# EAGLE design TailBoardA (EAGLE 9.1.3)
CNAME: BotaLab; CREVISION: 1.1; DESIGNER: botamochi6277
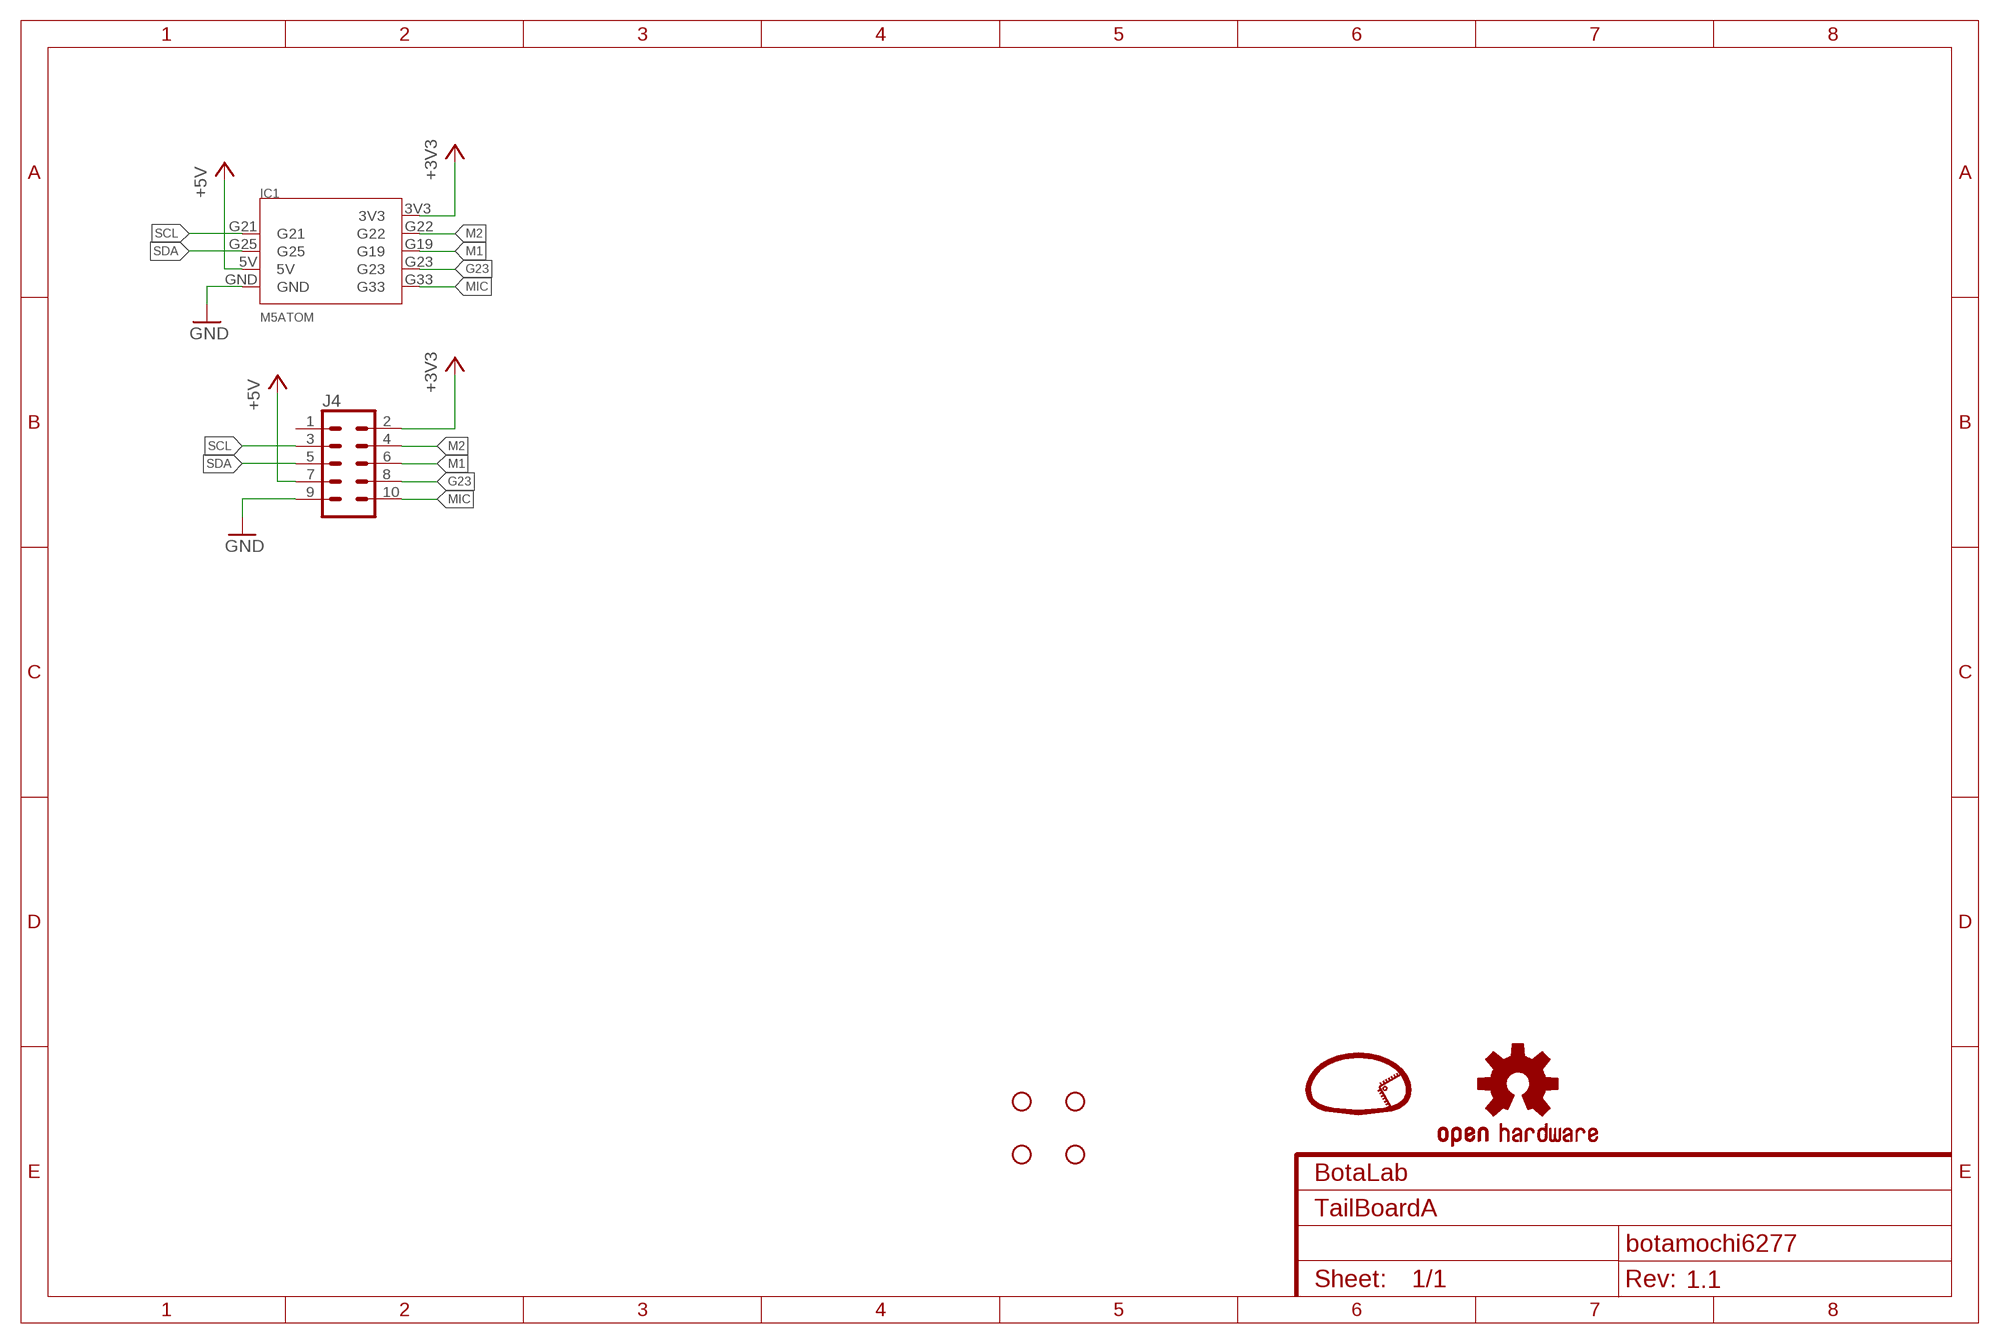
[diagram p0: schematic, sheet 1]

## Parts
H1  STAND-OFF2.1  [STAND-OFF-2.1]
H2  STAND-OFF2.1  [STAND-OFF-2.1]
H3  STAND-OFF2.1  [STAND-OFF-2.1]
H4  STAND-OFF2.1  [STAND-OFF-2.1]
IC1  M5ATOM  [M5ATOM]
J4  CONN_05X2SHD  [2X5-SHROUDED]
LOGO1  LOGO  [LOGO]
LOGO2  OSHW-LOGOS  [OSHW-LOGO-S]

## Nets
+3V3 [pwr]: IC1.3V3 J4.2
+5V [pwr]: IC1.5V J4.7
G23: IC1.G23 J4.8
GND [pwr]: IC1.GND J4.9
M1: IC1.G19 J4.6
M2: IC1.G22 J4.4
MIC: IC1.G33 J4.10
SCL: IC1.G21 J4.3
SDA: IC1.G25 J4.5
Unconnected: J4.1

## Library data of the parts
H1-H4 = Botamochi-sensors:STAND-OFF: Stand Off Drill holes for mechanically mounting via screws, standoffs, etc. Note: Use the keepout ring to avoid running the screw head into surrounding components. Variant Overviews STAND-OFF - Mechanical footprint for a #4 phillips button head screw. STAND-OFF-TIGHT - Mechanical footprint for a #4 phillips button head screw, Example SparkFun Products Screw - Phillips Head (1/4", 4-40, 10 pack) <https://www.sparkfun.com/products/10453> (PRT-10453) Screw - Phillips Head (1/2", 4-40, 10 pack) <https://www.sparkfun.com/products/10452> (PRT-10452) Screw - Phillips Head (3/4", 4-40, 10 pack) <https://www.sparkfun.com/products/10451> (PRT-10451) Screw - Phillips Head (1", 4-40, 10 pack) <https://www.sparkfun.com/products/10450> (PRT-10450)
IC1 = M5Atom:M5ATOM: Design for M5Atom Series
J4 = SparkFun-Connectors:CONN_05X2: Multi connection point. Often used as Generic Header-pin footprint for 0.1 inch spaced/style header connections For AVR SPI programming port, see special device with nice symbol: "AVR_SPI_PROG_5x2.dev" You can populate with any combo of single row headers, but if you'd like an exact match, check these: 2x5 AVR ICSP Male Header <https://www.sparkfun.com/products/778> (PRT-00778) 2x5 Pin Shrouded Header <https://www.sparkfun.com/products/8506> (PRT-08506) On any of the 0.1 inch spaced packages, you can populate with these: Break Away Headers - Straight <https://www.sparkfun.com/products/116> (PRT-00116) Break Away Male Headers - Right Angle <https://www.sparkfun.com/products/553> (PRT-00553) Female Headers <https://www.sparkfun.com/products/115> (PRT-00115) Break Away Headers - Machine Pin <https://www.sparkfun.com/products/117> (PRT-00117) Break Away Female Headers - Swiss Machine Pin <https://www.sparkfun.com/products/743> (PRT-00743) Special note: the shrouded connector mates well with our 5x2 ribbon cables: 2x5 Pin IDC Ribbon Cable <https://www.sparkfun.com/products/8535> (PRT-08535); PROD_ID: CONN-08671; SF_ID: PRT-08506
LOGO1 = botamochi-symbol:LOGO
LOGO2 = SparkFun-Aesthetics:OSHW-LOGO: Open-Source Hardware (OSHW) Logo This logo indicates the piece of hardware it is found on incorporates a OSHW license and/or adheres to the definition of open source hardware found here: http://freedomdefined.org/OSHW

## Net classes
0 default: width 0.5 mm
1 pwr: width 1 mm, clearance 0.5 mm

## Board
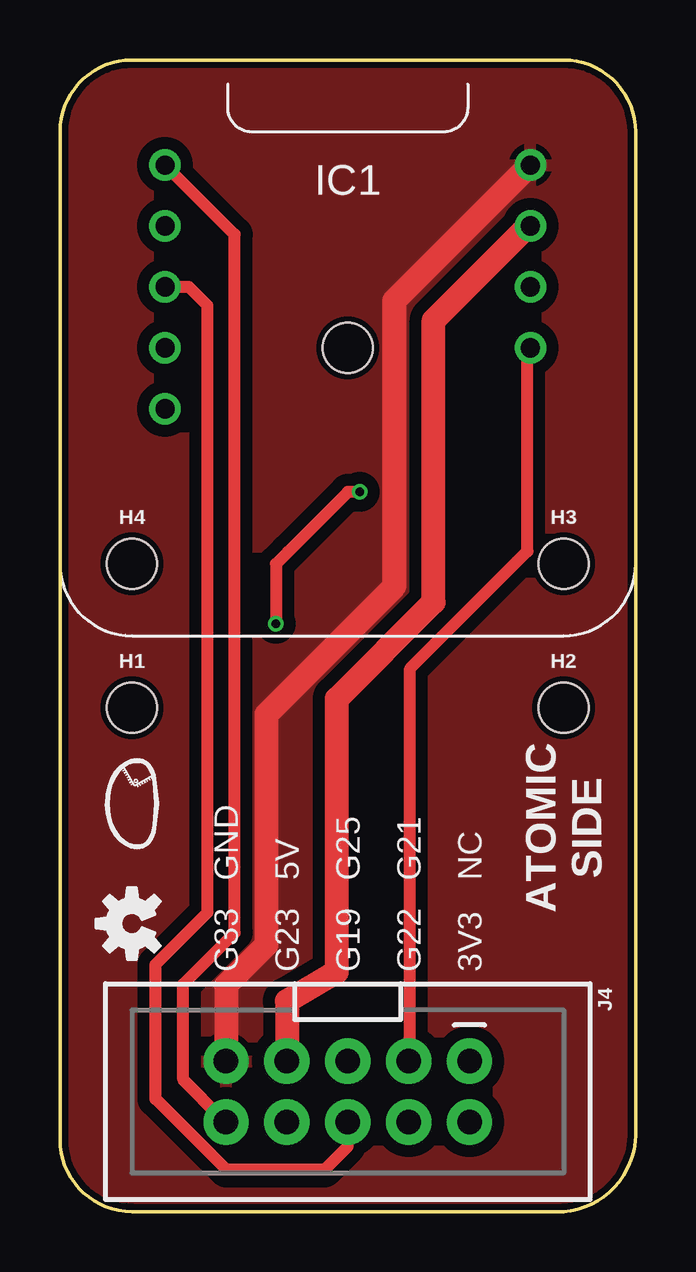
[diagram p1: board, top side]
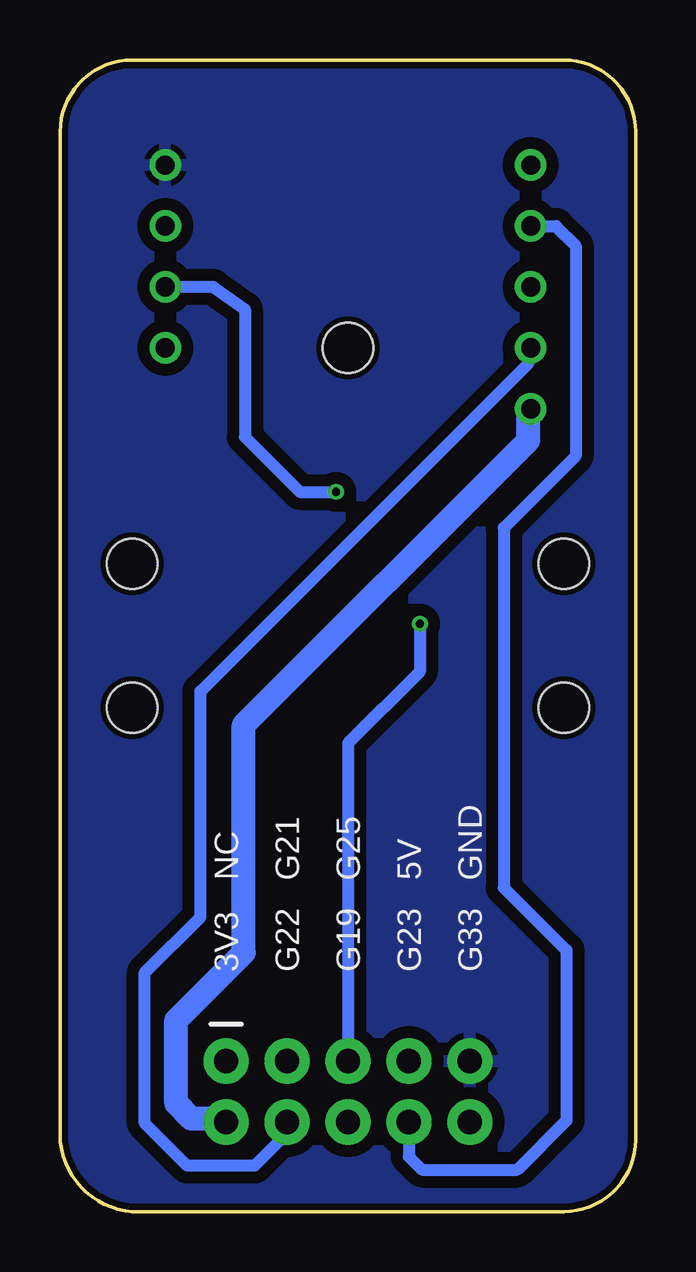
[diagram p2: board, bottom side, seen from below]

Size 24.01 x 48 mm. Coordinates in mm from the lower left corner, seen from the top.
Outline: 21,0 arc90 24,3.5 24,45 arc90 21,48 3,48 arc90 0,45 0,3 arc90 3,0 21,0
Copper layers (1*16): Top 0.035mm / dielectric 1.5mm / Bottom 0.035mm
Design rules "ssci_SeeedStudio_2layer_DRU_no_angle *": minimum track width 0.5mm, minimum drill 12mil, track to track 6mil, track to pad 6mil, pad to pad 6mil, via to via 6mil, smd to smd 0mil, copper to edge 10mil, drill to drill 10mil, minimum pad ring 10mil, minimum via ring 6mil, stop-mask expansion 2mil, vias tented up to drill 25mil, thermal gap 10mil

### Footprints (pad centres in the part's own frame; a part is rotated, then mirrored left to right if it is on the bottom)
STAND-OFF-2.1 = hole 2.1: 0,0
M5ATOM = drill 0.8: 3V3 7.62,2.54; 5V -7.62,-5.08; G19 7.62,-2.54; G21 -7.62,0; G22 7.62,0; G23 7.62,-5.08; G25 -7.62,-2.54; G33 7.62,-7.62; GND -7.62,-7.62 | hole 2.1: 0,0
2X5-SHROUDED = drill 1.016 pad 1.88: 1 -1.27,5.08; 2 1.27,5.08; 3 -1.27,2.54; 4 1.27,2.54; 5 -1.27,0; 6 1.27,0; 7 -1.27,-2.54; 8 1.27,-2.54; 9 -1.27,-5.08; 10 1.27,-5.08

### Placement (x,y rotation side)
H1  3,21 0 top
H2  21,21 0 top
H3  21,27 0 top
H4  3,27 0 top
IC1  12,36 180 top
J4  12,5 270 top
LOGO1  3,17 90 top
LOGO2  3,12 90 top

### Tracks (layer width: path | path; a pad name or v marks a point on that pad's centre or on a via)
+3V3
  Bottom 1: IC1.3V3 4.49,33.39 4.49,32.14 16.35,20.28 16.35,10.79 19.16,7.97 19.16,4.5 18.53,3.87 17.21,3.87 J4.2
+5V
  Top 1: IC1.5V 19.49,41.06 15.58,37.14 15.58,25.4 11.54,21.37 11.54,9.98 9.46,8.77 J4.7
G23
  Bottom 0.5: J4.8 9.46,2.29 8.91,1.74 4.94,1.74 2.89,3.8 2.89,10.89 5.5,13.5 5.5,28.5 2.5,31.5 2.5,40.26 3.32,41.08 IC1.G23
GND
  Top 1: IC1.GND 19.49,43.51 13.95,37.96 13.95,26.05 8.6,20.7 8.6,11.1 6.92,9.42 J4.9
  pour Bottom: -1,48 -1,0 25,0 25,48
  pour Top: -0.5,48 -0.5,0 24.5,0 24.5,48
M1
  Top 0.5: J4.6 12,2.72 11.02,1.74 6.94,1.74 3.99,4.7 3.99,10.3 6.15,12.46 6.15,37.77 5.38,38.54 IC1.G19
M2
  Bottom 0.5: IC1.G22 4.49,35.84 4.49,35.35 18.16,21.68 18.16,12.28 20.47,9.96 20.47,3.69 18.7,1.91 15.89,1.91 14.54,3.27 J4.4
MIC
  Top 0.5: J4.10 6.77,3.87 5.14,5.5 5.14,9.47 7.29,11.62 7.29,40.72 4.39,43.62 IC1.G33
SCL
  Top 0.5: IC1.G21 19.49,35.84 19.49,27.52 14.6,22.63 14.6,6.32 J4.3
SDA  (via drill 0.35)
  Top 0.5: v9,24.5 9,27 9.5,27.5 12,30 v12.5,30
  Bottom 0.5: J4.5 11.99,6.32 11.99,19.51 9,22.5 v9,24.5 | IC1.G25 17.62,38.54 16.29,37.6 16.29,32.29 14,30 v12.5,30

### Text on the board
tNames: ATOMIC / SIDE | GND | 5V | G25 | G21 | NC | G33 | G23 | G19 | G22 | 3V3
bNames: GND | 5V | G25 | G21 | NC | G33 | G23 | G19 | G22 | 3V3